# EAGLE schematic V3 nrf5 (EAGLE 9.6.2)
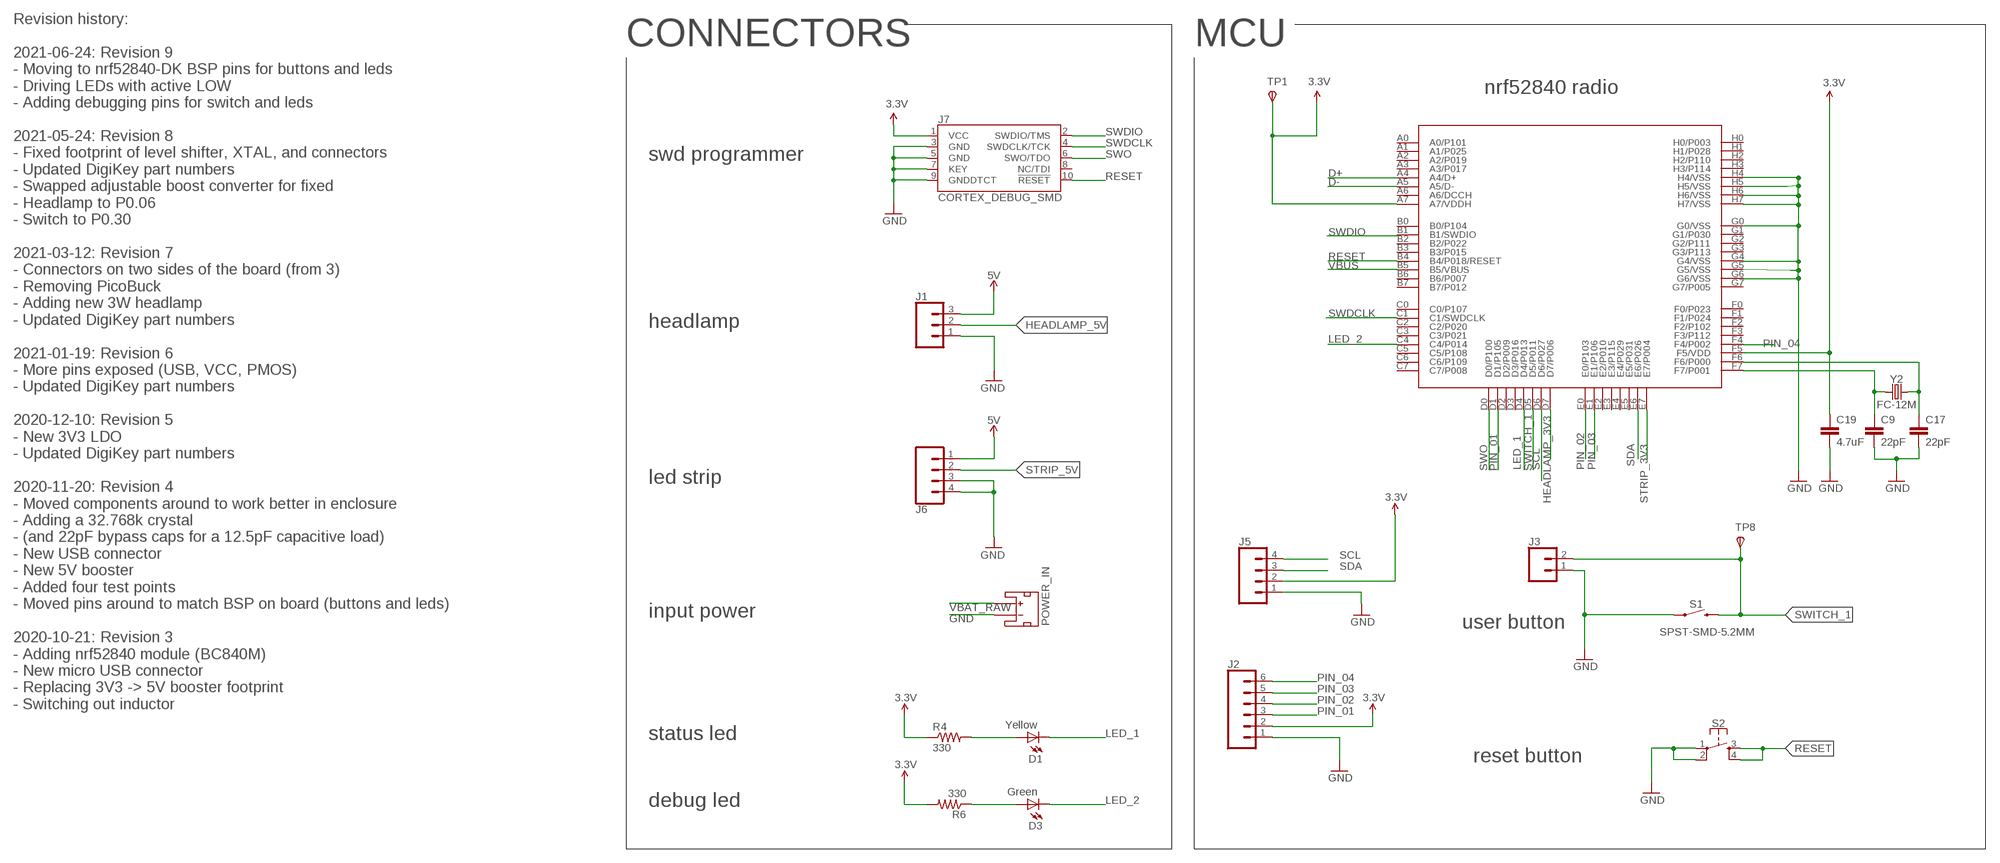
[diagram p0: schematic, sheet 1, part 1 of 2]
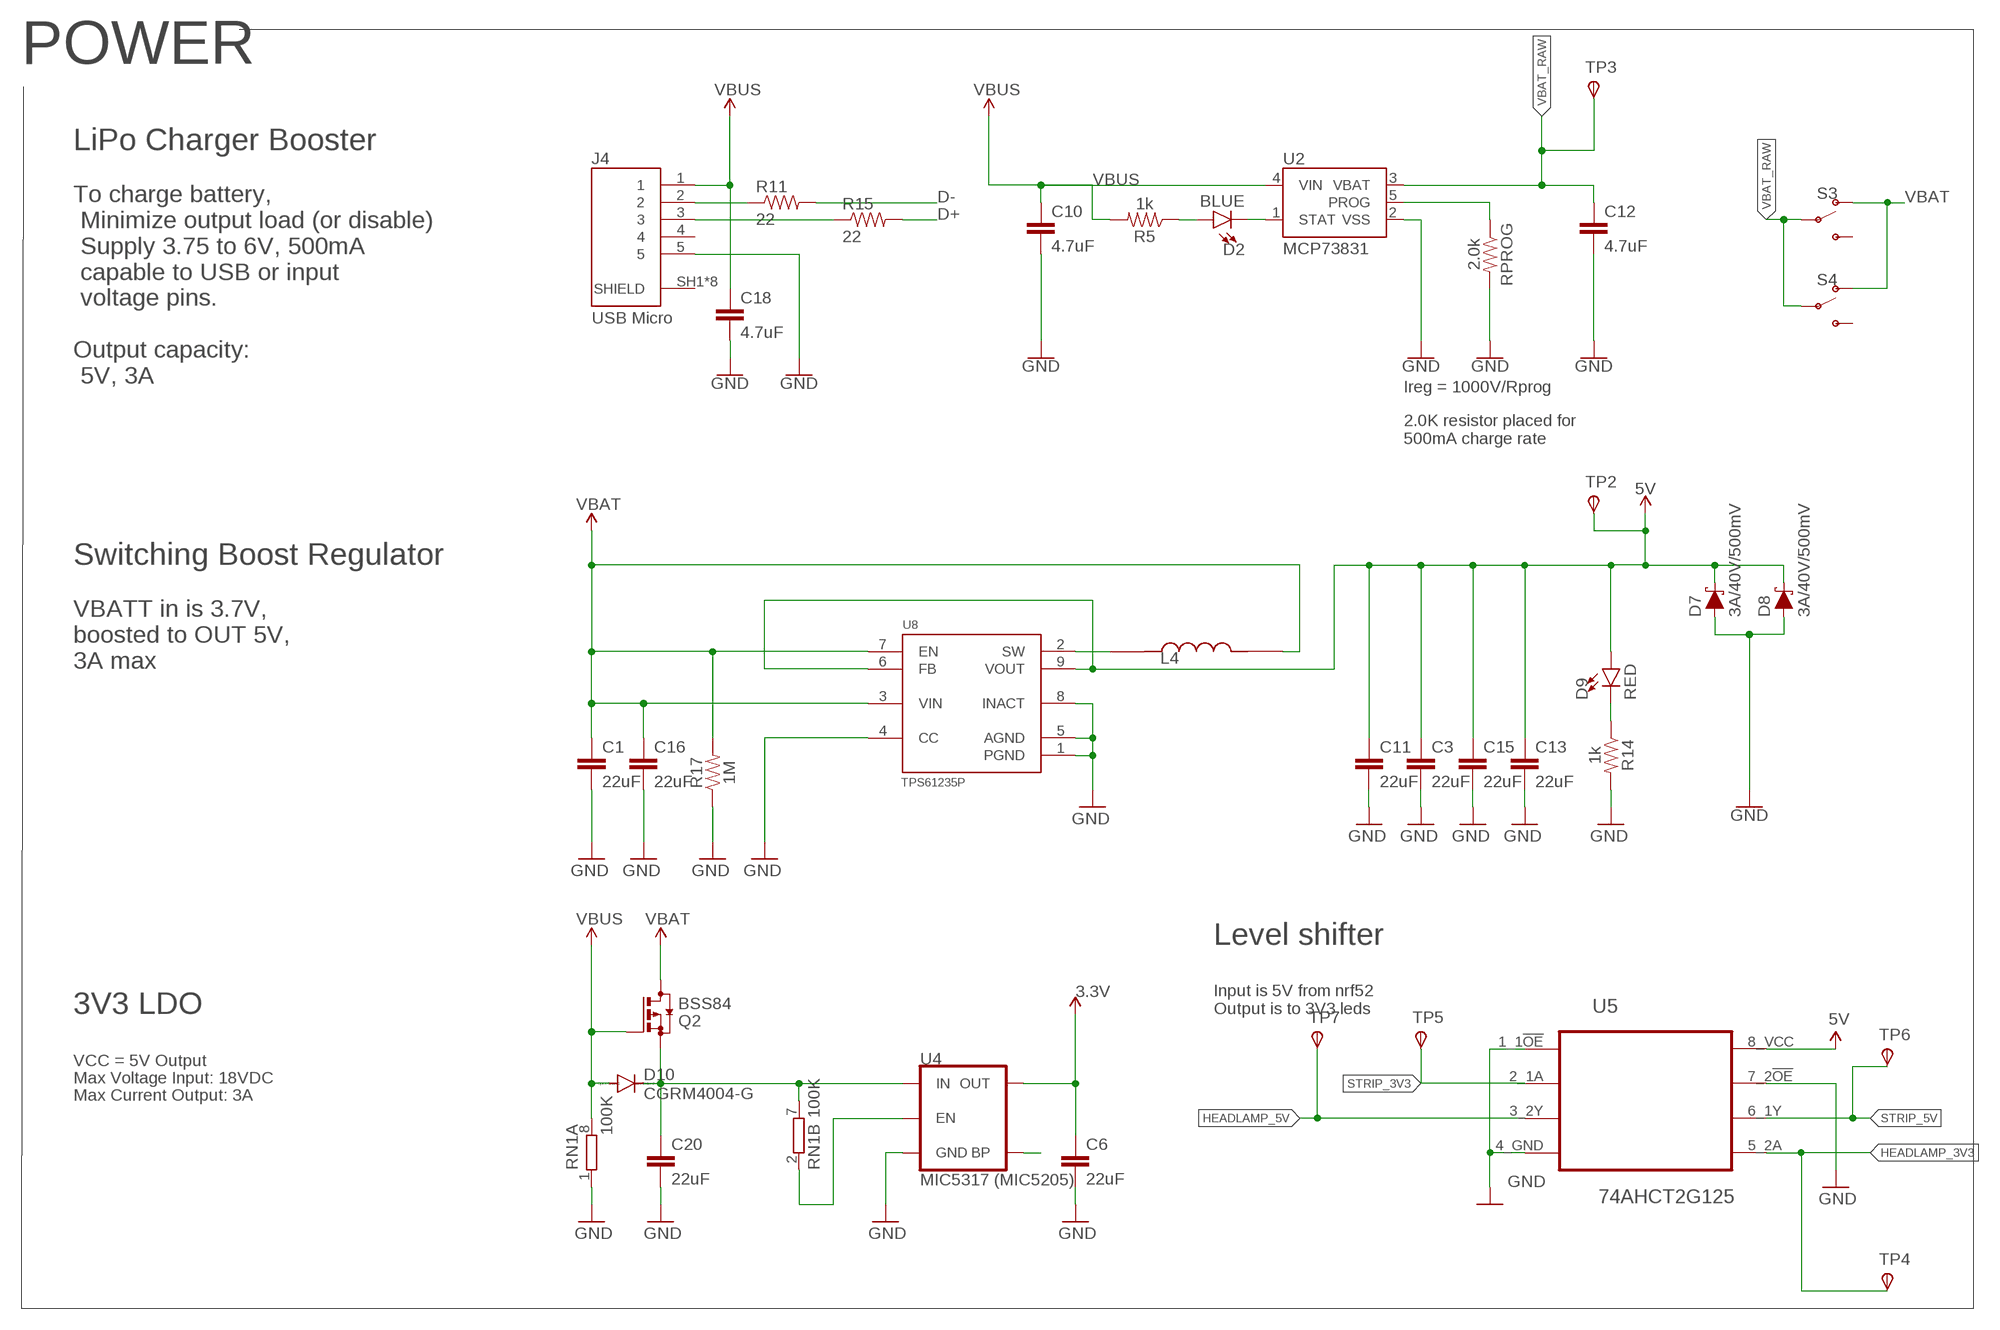
[diagram p1: schematic, sheet 1, part 2 of 2]

## Parts
C1  22uF  22UF-0805-6.3V-20%  [0805]
C3  22uF  22UF-0805-6.3V-20%  [0805]
C6  22uF  22UF-0805-6.3V-20%  [0805]
C9  22pF  22UF-0805-6.3V-20%  [0805]
C10  4.7uF  4.7UF0603  [0603]
C11  22uF  22UF-0805-6.3V-20%  [0805]
C12  4.7uF  4.7UF0603  [0603]
C13  22uF  22UF-0805-6.3V-20%  [0805]
C15  22uF  22UF-0805-6.3V-20%  [0805]
C16  22uF  22UF-0805-6.3V-20%  [0805]
C17  22pF  22UF-0805-6.3V-20%  [0805]
C18  4.7uF  4.7UF0603  [0603]
C19  4.7uF  4.7UF0603  [0603]
C20  22uF  22UF-0805-6.3V-20%  [0805]
D1  Yellow  LED0603  [LED-0603]
D2  BLUE  LED-BLUE0603  [LED-0603]
D3  Green  LED0603  [LED-0603]
D7  3A/40V/500mV  DIODE-SCHOTTKY-B340A  [SMA-DIODE]
D8  3A/40V/500mV  DIODE-SCHOTTKY-B340A  [SMA-DIODE]
D9  RED  LED-RED0603  [LED-0603]
D10  CGRM4004-G  [SOD-123_MINI-SMA]
J1  CONN_03SCREW_LOCK  [SCREWTERMINAL-3.5MM-3_LOCK.007S]
J2  CONN_06SMD-1MM  [1X06-1MM]
J3  CONN_02  [1X02]
J4  USB Micro  1050170001  [MOLEX_1050170001]
J5  CONN_04SMD2  [1X04_1MM_RA]
J6  CONN_04SCREW  [SCREWTERMINAL-3.5MM-4]
J7  CORTEX_DEBUG_SMD  [SAMTECH_FTSH-105-01]
L4  1.0 uH  FDSD0630-H-1R0M=P3  [IND_FDSD0630-H-1R0M=P3]
POWER_IN  JST_2MM_MALE  [JST-2-SMD]
Q2  BSS84  [SOT23]
R4  330  RESISTOR0603-RES  [0603-RES]
R5  1k  1KOHM-0603-1/10W-1%  [0603]
R6  330  RESISTOR0603-RES  [0603-RES]
R11  22  RESISTOR0603-RES  [0603-RES]
R14  1k  1KOHM-0603-1/10W-1%  [0603]
R15  22  RESISTOR0603-RES  [0603-RES]
R17  1M  750KOHM-0603-1/10W-1%  [0603@1]
RN1  100K  4R-NEXB38V  [EXB38V]
RPROG  2.0k  2.0KOHM-0603-1/10W-5%  [0603]
S1  SPST-SMD-5.2MM  MOMENTARY-SWITCH-SPST-SMD-5.2MM  [TACTILE_SWITCH_SMD_5.2MM]
S2  MOMENTARY-SWITCH-SPST-2-SMD-4.6X2.8MM  [TACTILE_SWITCH_SMD_4.6X2.8MM]
S3  SWITCH-SPDT-SMD-RIGHT-ANGLE  [SWITCH_SPST_SMD_A]
S4  SWITCH-SPDT-PTH-11.6X4.0MM  [SWITCH_SPDT_PTH_11.6X4.0MM]
TP1  TPSB1,27  [B1,27]
TP2  TPSB1,27  [B1,27]
TP3  TPSB1,27  [B1,27]
TP4  TPSB1,27  [B1,27]
TP5  TPSB1,27  [B1,27]
TP6  TPSB1,27  [B1,27]
TP7  TPSB1,27  [B1,27]
TP8  TPSB1,27  [B1,27]
U2  MCP73831  [SOT23-5]
U3  BC840M  [BC840M]
U4  MIC5317 (MIC5205)  V_REG_MIC52053.3V  [SOT23-5]
U5  74AHCT2G125  VSSOP-8_DEVICE  [VSSOP-8]
U8  TPS61235P  TPS61235PRWLR  [CONV_TPS61235PRWLR]
Y2  FC-12M  [FC-12M]

## Nets
3.3V: C6.1 C19.1 J2.2 J5.2 J7.1(VCC) R4.1 R6.2 TP1.TP(PP) U3.A7(A7/VDDH) U3.F5(F5/VDD) U4.5(OUT) ; supply symbol labelled VCC
5V: C3.1 C11.1 C13.1 C15.1 D7.C D8.C D9.A J1.3 J6.1 TP2.TP(PP) U5.8_VCC U8.6(FB) U8.9(VOUT)
D+: R15.2 U3.A4(A4/D+)
D-: R11.2 U3.A5(A5/D-)
GND: C1.2 C3.2 C6.2 C9.2 C10.2 C11.2 C12.2 C13.2 C15.2 C16.2 C17.2 C18.2 C19.2 C20.2 D7.A D8.A J1.1 J2.1 J3.1 J4.5 J5.1 J6.3 J6.4 J7.3(GND) J7.5(GND) J7.7(KEY) J7.9(GNDDTCT) POWER_IN.1(-) R14.2 R17.1 RN1.1 RPROG.2 S1.1 S2.1 S2.2 U2.2(VSS) U3.G0(G0/VSS) U3.G4(G4/VSS) U3.G5(G5/VSS) U3.G6(G6/VSS) U3.H4(H4/VSS) U3.H5(H5/VSS) U3.H6(H6/VSS) U3.H7(H7/VSS) U4.2(GND) U5.1_1!OE U5.4_GND U5.7_2!OE U8.1(PGND) U8.4(CC) U8.5(AGND) U8.8(INACT)
HEADLAMP_3V3: TP4.TP(PP) U3.D7(D7/P006) U5.5_2A
HEADLAMP_5V: J1.2 TP7.TP(PP) U5.3_2Y
LED_1: D1.C U3.D4(D4/P013)
LED_2: D3.C U3.C4(C4/P014)
N$1: D1.A R4.2
N$2: C9.1 U3.F7(F7/P001) Y2.1
N$3: L4.1 U8.2(SW)
N$4: C20.1 D10.C Q2.2(S) RN1.7 U4.1(IN)
N$5: RN1.2 U4.3(EN)
N$6: U4.4(BP)
N$8: D3.A R6.1
N$11: RPROG.1 U2.5(PROG)
N$12: J4.2 R11.1
N$13: D9.C R14.1
N$14: D2.C U2.1(STAT)
N$15: D2.A R5.1
N$16: J4.3 R15.1
N$17: C17.1 U3.F6(F6/P000) Y2.2
PIN_01: J2.3 U3.D1(D1/P105)
PIN_02: J2.4 U3.E0(E0/P103)
PIN_03: J2.5 U3.E1(E1/P106)
PIN_04: J2.6 U3.F4(F4/P002)
RESET: J7.10(!RESET) S2.3 S2.4 U3.B4(B4/P018/RESET)
SCL: J5.4 U3.D6(D6/P027)
SDA: J5.3 U3.E6(E6/P026)
STRIP_3V3: TP5.TP(PP) U3.E7(E7/P004) U5.2_1A
STRIP_5V: J6.2 TP6.TP(PP) U5.6_1Y
SWDCLK: J7.4(SWDCLK/TCK) U3.C1(C1/SWDCLK)
SWDIO: J7.2(SWDIO/TMS) U3.B1(B1/SWDIO)
SWITCH_1: J3.2 S1.3 TP8.TP(PP) U3.D5(D5/P011)
SWO: J7.6(SWO/TDO) U3.D0(D0/P100)
VBAT: C1.1 C16.1 L4.2 Q2.3(D) R17.2 S3.1(O) S4.1(O) U8.3(VIN) U8.7(EN)
VBAT_RAW: C12.1 POWER_IN.2(+) S3.2(P) S4.2(P) TP3.TP(PP) U2.3(VBAT)
VBUS: C10.1 C18.1 D10.A J4.1 Q2.1(G) R5.2 RN1.8 U2.4(VIN) U3.B5(B5/VBUS)
Unconnected: J4.4 J4.SH1(SHIELD) J4.SH2(SHIELD) J4.SH3(SHIELD) J4.SH4(SHIELD) J4.SH5(SHIELD) J4.SH6(SHIELD) J4.SH7(SHIELD) J4.SH8(SHIELD) J7.8(NC/TDI) POWER_IN.NC1(PAD1) POWER_IN.NC2(PAD2) RN1.3 RN1.4 RN1.5 RN1.6 S3.3(S) S4.3(S) U3.A0(A0/P101) U3.A1(A1/P025) U3.A2(A2/P019) U3.A3(A3/P017) U3.A6(A6/DCCH) U3.B0(B0/P104) U3.B2(B2/P022) U3.B3(B3/P015) U3.B6(B6/P007) U3.B7(B7/P012) U3.C0(C0/P107) U3.C2(C2/P020) U3.C3(C3/P021) U3.C5(C5/P108) U3.C6(C6/P109) U3.C7(C7/P008) U3.D2(D2/P009) U3.D3(D3/P016) U3.E2(E2/P010) U3.E3(E3/P115) U3.E4(E4/P029) U3.E5(E5/P031) U3.F0(F0/P023) U3.F1(F1/P024) U3.F2(F2/P102) U3.F3(F3/P112) U3.G1(G1/P030) U3.G2(G2/P111) U3.G3(G3/P113) U3.G7(G7/P005) U3.H0(H0/P003) U3.H1(H1/P028) U3.H2(H2/P110) U3.H3(H3/P114)

## Notes on the sheet
- Revision history:
  
  2021-06-24: Revision 9
  - Moving to nrf52840-DK BSP pins for buttons and leds
  - Driving LEDs with active LOW
  - Adding debugging pins for switch and leds
  
  2021-05-24: Revision 8
  - Fixed footprint of level shifter, XTAL, and connectors
  - Updated DigiKey part numbers
  - Swapped adjustable boost converter for fixed
  - Headlamp to P0.06
  - Switch to P0.30
  
  2021-03-12: Revision 7
  - Connectors on two sides of the board (from 3)
  - Removing PicoBuck
  - Adding new 3W headlamp
  - Updated DigiKey part numbers
  
  2021-01-19: Revision 6
  - More pins exposed (USB, VCC, PMOS)
  - Updated DigiKey part numbers
  
  2020-12-10: Revision 5
  - New 3V3 LDO
  - Updated DigiKey part numbers
  
  2020-11-20: Revision 4
  - Moved components around to work better in enclosure
  - Adding a 32.768k crystal 
  - (and 22pF bypass caps for a 12.5pF capacitive load) 
  - New USB connector
  - New 5V booster
  - Added four test points
  - Moved pins around to match BSP on board (buttons and leds)
  
  2020-10-21: Revision 3
  - Adding nrf52840 module (BC840M)
  - New micro USB connector
  - Replacing 3V3 -> 5V booster footprint
  - Switching out inductor
- CONNECTORS | MCU | POWER
- nrf52840 radio
- LiPo Charger Booster
- To charge battery,
   Minimize output load (or disable)
   Supply 3.75 to 6V, 500mA
   capable to USB or input
   voltage pins.
- swd programmer
- Output capacity:
   5V, 3A
- Ireg = 1000V/Rprog
- 2.0K resistor placed for
  500mA charge rate
- headlamp
- Switching Boost Regulator
- VBATT in is 3.7V, 
  boosted to OUT 5V, 
  3A max
- led strip
- input power
- user button | Level shifter
- 3V3 LDO
- Input is 5V from nrf52
  Output is to 3V3 leds
- VCC = 5V Output
- Max Voltage Input: 18VDC
- Max Current Output: 3A
- status led
- reset button
- debug led

## Library data of the parts
C1 C3 C6 C11 C13 C15 C16 C20 = SparkFun-Capacitors:22UF: 22µF ceramic capacitors A capacitor is a passive two-terminal electrical component used to store electrical energy temporarily in an electric field.; DIGIKEY: 490-10511-1-ND; PROD_ID: CAP-08402
C9 C17 = SparkFun-Capacitors:22UF: 22µF ceramic capacitors A capacitor is a passive two-terminal electrical component used to store electrical energy temporarily in an electric field.; DIGIKEY: 399-C0805C220K5HAC7800CT-ND; PROD_ID: CAP-08402; VALUE: 22uF
C10 C12 C18 C19 = SparkFun-Capacitors:4.7UF: 4.7µF ceramic capacitors A capacitor is a passive two-terminal electrical component used to store electrical energy temporarily in an electric field.; DIGIKEY: 399-3482-1-ND; PROD_ID: CAP-08280
D1 = SparkFun:LED: LEDs Standard schematic elements and footprints for 5mm, 3mm, 1206, and 0603 sized LEDs. 5mm - Spark Fun Electronics SKU : COM-00529 (and others); DIGIKEY: 350-4349-2-ND
D2 = SparkFun-LED:LED-BLUE: Blue SMD LED Used in manufacturing of various products at SparkFun Packages: 0603 - SMD 0603 package [Product Link] <http://www.digikey.com/product-detail/en/SMLE12BC7TT86/511-1589-2-ND/1641808> 1206 - SMD1206 package [Product Link] <http://www.digikey.com/product-detail/en/lite-on-inc/LTST-C150TBKT/160-1643-1-ND/573584> SparkFun Products: ESP8266 Thing-Dev Board <https://www.sparkfun.com/products/13711> RedBoard <https://www.sparkfun.com/products/12757>; DIGIKEY: 160-1647-1-ND; PROD_ID: DIO-08575
D3 = SparkFun:LED: LEDs Standard schematic elements and footprints for 5mm, 3mm, 1206, and 0603 sized LEDs. 5mm - Spark Fun Electronics SKU : COM-00529 (and others); DIGIKEY: 754-1116-1-ND
D7 D8 = SparkFun-DiscreteSemi:DIODE-SCHOTTKY: Schottky diode A Schottky diode is a semiconductor diode which has a low forward voltage drop and a very fast switching action.; DIGIKEY: B240AE-13DITR-ND; PROD_ID: DIO-09886
D9 = SparkFun-LED:LED-RED: Red SMD LED Used in manufacturing of most products at SparkFun Packages: 0603 - SMD 0603 package [Product Link] <http://docs.avagotech.com/docs/AV02-0551EN> 0603 SMART - SMD 0603 SMART package ( more efficient and expensive)[Product Link] <http://www.osram-os.com/Graphics/XPic2/00077099_0.pdf> 1206 - SMD1206 package [Product Link] <https://www.sparkfun.com/datasheets/DevTools/LilyPad/Q150OVS4.pdff> SparkFun Products: Pro Mini 328 -5V <https://www.sparkfun.com/products/821> RedBoard <https://www.sparkfun.com/products/12757> IOIO-OTG <https://www.sparkfun.com/products/13613>; DIGIKEY: 160-1436-1-ND; PROD_ID: DIO-00819
D10 = diode:CGRM400*-G: Molded plasitc,JEDEC SOD-123/Mini SMA Source: Comchip CGRM4001-G.pdf; DIGIKEY: MBR120LSFT3GOSTR-ND
J1 = SparkFun-Connectors:CONN_03: Multi connection point. Often used as Generic Header-pin footprint for 0.1 inch spaced/style header connections On any of the 0.1 inch spaced packages, you can populate with these: Break Away Headers - Straight <https://www.sparkfun.com/products/116> (PRT-00116) Break Away Male Headers - Right Angle <https://www.sparkfun.com/products/553> (PRT-00553) Female Headers <https://www.sparkfun.com/products/115> (PRT-00115) Break Away Headers - Machine Pin <https://www.sparkfun.com/products/117> (PRT-00117) Break Away Female Headers - Swiss Machine Pin <https://www.sparkfun.com/products/743> (PRT-00743) Stackable Header - 3 Pin (Female, 0.1") <https://www.sparkfun.com/products/13875> (PRT-13875) For SCREWTERMINALS and SPRING TERMINALS visit here: Screw Terimnals on SparkFun.com <https://www.sparkfun.com/search/results?term=Screw+Terminals> (5mm/3.5mm/2.54mm spacing) This device is also useful as a general connection point to wire up your design to another part of your project. Our various solder wires solder well into these plated through hole pads. Hook-Up Wire - Assortment (Stranded, 22 AWG) <https://www.sparkfun.com/products/11375> (PRT-11375) Hook-Up Wire - Assortment (Solid Core, 22 AWG) <https://www.sparkfun.com/products/11367> (PRT-11367) View the entire wire category on our website here <https://www.sparkfun.com/categories/141> Special notes: Molex polarized connector foot print use with SKU : PRT-08232 with associated crimp pins and housings.; DIGIKEY: A98037-ND; PROD_ID: CONN-08288; SF_ID: PRT-08235
J2 = SparkFun-Connectors:CONN_06: Multi connection point. Often used as Generic Header-pin footprint for 0.1 inch spaced/style header connections On any of the 0.1 inch spaced packages, you can populate with these: Break Away Headers - Straight <https://www.sparkfun.com/products/116> (PRT-00116) Break Away Male Headers - Right Angle <https://www.sparkfun.com/products/553> (PRT-00553) Female Headers <https://www.sparkfun.com/products/115> (PRT-00115) Break Away Headers - Machine Pin <https://www.sparkfun.com/products/117> (PRT-00117) Break Away Female Headers - Swiss Machine Pin <https://www.sparkfun.com/products/743> (PRT-00743) Arduino Stackable Header - 6 Pin <https://www.sparkfun.com/products/9280> (PRT-09280) For SCREWTERMINALS and SPRING TERMINALS visit here: Screw Terimnals on SparkFun.com <https://www.sparkfun.com/search/results?term=Screw+Terminals> (5mm/3.5mm/2.54mm spacing) This device is also useful as a general connection point to wire up your design to another part of your project. Our various solder wires solder well into these plated through hole pads. Hook-Up Wire - Assortment (Stranded, 22 AWG) <https://www.sparkfun.com/products/11375> (PRT-11375) Hook-Up Wire - Assortment (Solid Core, 22 AWG) <https://www.sparkfun.com/products/11367> (PRT-11367) View the entire wire category on our website here <https://www.sparkfun.com/categories/141>; PROD_ID: CONN-08249; SF_ID: GPS-00579
J3 = SparkFun-Connectors:CONN_02: Multi connection point. Often used as Generic Header-pin footprint for 0.1 inch spaced/style header connections On any of the 0.1 inch spaced packages, you can populate with these: Break Away Headers - Straight <https://www.sparkfun.com/products/116> (PRT-00116) Break Away Male Headers - Right Angle <https://www.sparkfun.com/products/553> (PRT-00553) Female Headers <https://www.sparkfun.com/products/115> (PRT-00115) Break Away Headers - Machine Pin <https://www.sparkfun.com/products/117> (PRT-00117) Break Away Female Headers - Swiss Machine Pin <https://www.sparkfun.com/products/743> (PRT-00743) For SCREWTERMINALS and SPRING TERMINALS visit here: Screw Terimnals on SparkFun.com <https://www.sparkfun.com/search/results?term=Screw+Terminals> (5mm/3.5mm/2.54mm spacing) This device is also useful as a general connection point to wire up your design to another part of your project. Our various solder wires solder well into these plated through hole pads. Hook-Up Wire - Assortment (Stranded, 22 AWG) <https://www.sparkfun.com/products/11375> (PRT-11375) Hook-Up Wire - Assortment (Solid Core, 22 AWG) <https://www.sparkfun.com/products/11367> (PRT-11367) View the entire wire category on our website here <https://www.sparkfun.com/categories/141> Special notes: Molex polarized connector foot print use with: PRT-08233 with associated crimp pins and housings. 2.54_SCREWTERM for use with PRT-10571. 3.5mm Screw Terminal footprints for PRT-08084 5mm Screw Terminal footprints for use with PRT-08432
J4 = 1050170001:1050170001: Conn.; Data; USB; Recept.; Micro; B Type; Bottom Mount, SMT, with Solder Tabs, Lead-Free Check prices <https://pricing.snapeda.com/parts/1050170001/Molex/view-part?ref=eda>; AVAILABILITY: Good; DESCRIPTION: USB - micro B USB 2.0 Receptacle Connector 5 Position Surface Mount, Right Angle; Through Hole; DIGIKEY: WM1399CT-ND; MF: Molex; MP: 1050170001; PACKAGE: None; PRICE: None; PURCHASE-URL: https://pricing.snapeda.com/search/part/1050170001/?ref=eda
J5 = SparkFun-Connectors:CONN_04: Multi connection point. Often used as Generic Header-pin footprint for 0.1 inch spaced/style header connections On any of the 0.1 inch spaced packages, you can populate with these: Break Away Headers - Straight <https://www.sparkfun.com/products/116> (PRT-00116) Break Away Male Headers - Right Angle <https://www.sparkfun.com/products/553> (PRT-00553) Female Headers <https://www.sparkfun.com/products/115> (PRT-00115) Break Away Headers - Machine Pin <https://www.sparkfun.com/products/117> (PRT-00117) Break Away Female Headers - Swiss Machine Pin <https://www.sparkfun.com/products/743> (PRT-00743) For SCREWTERMINALS and SPRING TERMINALS visit here: Screw Terimnals on SparkFun.com <https://www.sparkfun.com/search/results?term=Screw+Terminals> (5mm/3.5mm/2.54mm spacing) This device is also useful as a general connection point to wire up your design to another part of your project. Our various solder wires solder well into these plated through hole pads. Hook-Up Wire - Assortment (Stranded, 22 AWG) <https://www.sparkfun.com/products/11375> (PRT-11375) Hook-Up Wire - Assortment (Solid Core, 22 AWG) <https://www.sparkfun.com/products/11367> (PRT-11367) View the entire wire category on our website here <https://www.sparkfun.com/categories/141> Special notes: Molex polarized connector foot print use with SKU : PRT-08231 with associated crimp pins and housings. 1MM SMD Version SKU: PRT-10208; PROD_ID: CONN-10310; SF_ID: PRT-10208
J6 = SparkFun-Connectors:CONN_04: Multi connection point. Often used as Generic Header-pin footprint for 0.1 inch spaced/style header connections On any of the 0.1 inch spaced packages, you can populate with these: Break Away Headers - Straight <https://www.sparkfun.com/products/116> (PRT-00116) Break Away Male Headers - Right Angle <https://www.sparkfun.com/products/553> (PRT-00553) Female Headers <https://www.sparkfun.com/products/115> (PRT-00115) Break Away Headers - Machine Pin <https://www.sparkfun.com/products/117> (PRT-00117) Break Away Female Headers - Swiss Machine Pin <https://www.sparkfun.com/products/743> (PRT-00743) For SCREWTERMINALS and SPRING TERMINALS visit here: Screw Terimnals on SparkFun.com <https://www.sparkfun.com/search/results?term=Screw+Terminals> (5mm/3.5mm/2.54mm spacing) This device is also useful as a general connection point to wire up your design to another part of your project. Our various solder wires solder well into these plated through hole pads. Hook-Up Wire - Assortment (Stranded, 22 AWG) <https://www.sparkfun.com/products/11375> (PRT-11375) Hook-Up Wire - Assortment (Solid Core, 22 AWG) <https://www.sparkfun.com/products/11367> (PRT-11367) View the entire wire category on our website here <https://www.sparkfun.com/categories/141> Special notes: Molex polarized connector foot print use with SKU : PRT-08231 with associated crimp pins and housings. 1MM SMD Version SKU: PRT-10208; DIGIKEY: 277-1860-ND; PROD_ID: 2xCONN-08399; SF_ID: 2xPRT-08084
J7 = SparkFun-Connectors:CORTEX_DEBUG: Cortex Debug Connector - 10 pin Supports JTAG debug, Serial Wire debug, and Serial Wire Viewer. PTH and SMD connector options available. General Connector Information <http://infocenter.arm.com/help/topic/com.arm.doc.faqs/attached/13634/cortex_debug_connectors.pdf> Products: PTH Connector <http://www.digikey.com/product-detail/en/cnc-tech/3220-10-0100-00/1175-1627-ND/3883661> -via Digi-Key SparkFun PSoc <https://www.sparkfun.com/products/13229> SparkFun T <https://www.sparkfun.com/products/13810>; DIGIKEY: SAM1161-05-ND
L4 = FDSD0630-H-1R0M_P3:FDSD0630-H-1R0M=P3: 2.2µH Shielded Wirewound Inductor 7.1A 17mOhm Max Nonstandard; DESCRIPTION: Inductor with Inductance: 1uH Tol. +/-20%, Package: 2726 (7066); DIGI-KEY_PART_NUMBER: 490-10878-1-ND; DIGIKEY: 490-10878-1-ND; MF: Murata; MP: FDSD0630-H-1R0M=P3; PACKAGE: NONSTANDARD; PURCHASE-URL: https://pricing.snapeda.com/search/part/FDSD0630-H-1R0M=P3/?ref=eda
POWER_IN = SparkFun-Connectors:JST_2MM_MALE: JST 2MM MALE RA CONNECTOR Two pin, compact surface mount connector. Commonly used as a battery input connection point. We really like the solid locking feeling and high current rating on these small connectors. We use these all the time as battery connectors. Mates to single-cell LiPo batteries. Here is the connector we sell at SparkFun: JST Right Angle Connector - White <https://www.sparkfun.com/products/8612> (PRT-08612) Datasheet <http://www.sparkfun.com/datasheets/Prototyping/Connectors/JST-Horizontal.pdf> It was used on these SparkFun products: SparkFun MOSFET Power Controller <https://www.sparkfun.com/products/11214> (PRT-11214) SparkFun Battery Babysitter - LiPo Battery Manager <https://www.sparkfun.com/products/13777> (PRT-13777) And many, many others that required a lipo battery connection.; DIGIKEY: 732-2711-2-ND; PROD_ID: CONN-11443; SF_ID: PRT-08612
Q2 = transistor-small-signal:BSS84: P-CHANNEL MOS FET; DIGIKEY: TSM2305CXRFGTR-ND
R4 R6 = SparkFun:RESISTOR: Resistor Basic schematic elements and footprints for 0603, 1206, and PTH resistors.; DIGIKEY: 311-330HRTR-ND
R5 = SparkFun-Resistors:1KOHM: 1kΩ resistor A resistor is a passive two-terminal electrical component that implements electrical resistance as a circuit element. Resistors act to reduce current flow, and, at the same time, act to lower voltage levels within circuits. - Wikipedia; DIGIKEY: RMCF0603FG1K00CT-ND; PROD_ID: RES-07856
R11 R15 = SparkFun:RESISTOR: Resistor Basic schematic elements and footprints for 0603, 1206, and PTH resistors.; DIGIKEY: 311-22.0HRTR-ND
R14 = SparkFun-Resistors:1KOHM: 1kΩ resistor A resistor is a passive two-terminal electrical component that implements electrical resistance as a circuit element. Resistors act to reduce current flow, and, at the same time, act to lower voltage levels within circuits. - Wikipedia; DIGIKEY: RMCF0603FG1K00; PROD_ID: RES-07856
R17 = SparkFun-Resistors:750KOHM: 750Ω resistor A resistor is a passive two-terminal electrical component that implements electrical resistance as a circuit element. Resistors act to reduce current flow, and, at the same time, act to lower voltage levels within circuits. - Wikipedia; DIGIKEY: RMCF0603FT1M00; PROD_ID: RES-13768; VALUE: 750K
RN1 = resistor-dil:4R-N: Array Chip Resistor Source: RS Component / Phycomp; DIGIKEY: YC164J-100KCT-ND; OC_FARNELL: unknown; OC_NEWARK: unknown
RPROG = SparkFun-Resistors:2.0KOHM: 2kΩ resistor A resistor is a passive two-terminal electrical component that implements electrical resistance as a circuit element. Resistors act to reduce current flow, and, at the same time, act to lower voltage levels within circuits. - Wikipedia; DIGIKEY: ‎311-2.00KHRCT-ND‎; PROD_ID: RES-08296
S1 = SparkFun-Switches:MOMENTARY-SWITCH-SPST: Momentary Switch (Pushbutton) - SPST Normally-open (NO) SPST momentary switches (buttons, pushbuttons). Variants PTH-12MM - 12mm square, through-hole Momentary Pushbutton Switch - 12mm Square <https://www.sparkfun.com/products/9190> (COM-09190) PTH-6.0MM, PTH-6.0MM-KIT - 6.0mm square, through-hole Mini Pushbutton Switch <https://www.sparkfun.com/products/97> (COM-00097) KIT package intended for soldering kit's - only one side of pads' copper is exposed. PTH-RIGHT-ANGLE-KIT - Right-angle, through-hole Right Angle Tactile Button <https://www.sparkfun.com/products/10791> - Used on SparkFun BigTime Watch Kit <https://www.sparkfun.com/products/11734> SMD-12MM - 12mm square, surface-mount Tactile Button - SMD (12mm) <https://www.sparkfun.com/products/12993> (COM-12993) Used on SparkFun PicoBoard <https://www.sparkfun.com/products/11888> SMD-4.5MM - 4.5mm Square Trackball Switch Used on SparkFun Blackberry Trackballer Breakout <https://www.sparkfun.com/products/13169> SMD-4.6MMX2.8MM - 4.60mm x 2.80mm, surface mount Used on SparkFun SAMD21 Mini Breakout <https://www.sparkfun.com/products/13664> SMD-5.2MM, SMD-5.2-REDUNDANT - 5.2mm square, surface-mount Mini Pushbutton Switch - SMD <https://www.sparkfun.com/products/8720> (COM-08720) Used on Arduino Pro Mini <https://www.sparkfun.com/products/11114> REDUNDANT package connects both switch circuits together SMD-6.0X3.5MM - 6.0 x 3.5mm, surface mount Momentary Reset Switch SMD <https://www.sparkfun.com/products/8229> (COM-08229) SMD-6.2MM-TALL - 6.2mm square, surface mount Tactile Button - SMD (6mm) <https://www.sparkfun.com/products/12992> Used on SparkFun Digital Sandbox <https://www.sparkfun.com/products/12651> SMD-RIGHT-ANGLE - Right-angle, surface mount Used on SparkFun Block for Intel® Edison - Arduino <https://www.sparkfun.com/products/13036>; DIGIKEY: CKN12222-1-ND; PROD_ID: SWCH-08247; SF_SKU: COM-08720
S2 = SparkFun-Switches:MOMENTARY-SWITCH-SPST-2: Momentary Switch (Pushbutton) - SPST - Two Circuits Normally-open (NO) SPST momentary switches (buttons, pushbuttons). Schematic symbol includes two switch circuits. Variants SMD-4.6MMX2.8MM - 4.60mm x 2.80mm Tactile Momentary Button Switch - Used on SparkFun SAMD21 Mini Breakout <https://www.sparkfun.com/products/13664> SMD-5.2MM - Mini Pushbutton Switch - SMD <https://www.sparkfun.com/products/8720> - Used on Arduino Pro Mini <https://www.sparkfun.com/products/11114>; DIGIKEY: 401-1426-1-ND; PROD_ID: SWCH-13065
S3 = SparkFun-Switches:SWITCH-SPDT: Single Pole, Double Throw (SPDT) Switch Single-pole, double-throw (SPDT) switch. Variant Overview SMD-AYZ0202 Surface Mount DPDT Switch <https://www.sparkfun.com/products/597> (COM-00597) Used on e.g. LilyPad Arduino USB - ATmega32U4 Board <https://www.sparkfun.com/products/12049> PTH-11.6X4.0MM SPDT Mini Power Switch <https://www.sparkfun.com/products/102> (COM-00102) Used on e.g. SparkFun Simon Says - Through-Hole Soldering Kit <https://www.sparkfun.com/products/10547> (KIT-10547) PTH-11.6X4.0MM-KIT KIT version of SPDT Mini Power Switch - Simplifies soldering by removing tStop of switch pins - only one side can be soldered. PTH-11.6X4.0MM-LOCK LOCK version of SPDT Mini Power Switch - Offset pins hold switch in place for easier soldering. SMD-RIGHT-ANGLE Surface Mount Right Angle Switch <https://www.sparkfun.com/products/10860> (COM-10860) Used on e.g. SparkFun ESP8266 Thing <https://www.sparkfun.com/products/13231>; DIGIKEY: 563-1102-1-ND; PROD_ID: SWCH-10651; SF_SKU: COM-10860
S4 = SparkFun-Switches:SWITCH-SPDT: Single Pole, Double Throw (SPDT) Switch Single-pole, double-throw (SPDT) switch. Variant Overview SMD-AYZ0202 Surface Mount DPDT Switch <https://www.sparkfun.com/products/597> (COM-00597) Used on e.g. LilyPad Arduino USB - ATmega32U4 Board <https://www.sparkfun.com/products/12049> PTH-11.6X4.0MM SPDT Mini Power Switch <https://www.sparkfun.com/products/102> (COM-00102) Used on e.g. SparkFun Simon Says - Through-Hole Soldering Kit <https://www.sparkfun.com/products/10547> (KIT-10547) PTH-11.6X4.0MM-KIT KIT version of SPDT Mini Power Switch - Simplifies soldering by removing tStop of switch pins - only one side can be soldered. PTH-11.6X4.0MM-LOCK LOCK version of SPDT Mini Power Switch - Offset pins hold switch in place for easier soldering. SMD-RIGHT-ANGLE Surface Mount Right Angle Switch <https://www.sparkfun.com/products/10860> (COM-10860) Used on e.g. SparkFun ESP8266 Thing <https://www.sparkfun.com/products/13231>; PROD_ID: SWCH-08261; SF_SKU: COM-00102
TP1-TP8 = testpad:TPS: TEST PIN
U2 = SparkFun-IC-Power:MCP73831: MCP73831T Li-Ion, Li-Pol Controller Miniature single cell, fully integrated Li-Ion, Li-polymer charge management controller Datasheet <http://ww1.microchip.com/downloads/en/DeviceDoc/20001984g.pdf> SparkFun Products: SparkFun ESP32 Thing <https://www.sparkfun.com/products/13907> SparkFun 9DoF Razor IMU M0 <https://www.sparkfun.com/products/14001>; DIGIKEY: MCP73832T-2DFI/OTTR-ND; PROD_ID: IC-09995
U3 = BC840M-v1:BC840M; DIGIKEY: 1914-BC840MCT-ND
U4 = SparkFun-IC-Power:V_REG_MIC5205: V_REG MIC5205 Standard 3.3V, 5V, and Adjustable 150mA LDO voltage regulator in SOT-23 layout. Micrel part MIC5205. BP (by-pass) pin is used to lower output noise with 470pF cap, may be left open. On the adjustable version BP is used to set output.; DIGIKEY: MIC5317-3.3YM5-TR-ND; MOUSER: 998-MIC5317-3.3YM5TR; PROD_ID: VREG-00822; VALUE: 3.3V/150mA
U5 = VSSOP8:VSSOP-8_DEVICE: Dual bidirectional I2C-bus and SMBus voltage-level translator; DIGIKEY: 1727-6544-1-ND‎; MPN: PCA9306DC,125; OC_FARNELL: -; OC_NEWARK: 70R6429; PACKAGE: VSSOP-8; SUPPLIER: NXP
U8 = TPS61235PRWLR:TPS61235PRWLR: TPS6123x 8-A Valley Current Synchronous Boost Converters with Constant Current Output Feature 9-VQFN-HR -40 to 85; DESCRIPTION: 8-A Valley Current Synchronous Boost Converters with Constant Current Output Feature 9-VQFN-HR -40 to 85; DIGI-KEY_PART_NUMBER: 296-47376-1-ND; DIGIKEY: 296-47376-2-ND; MF: Texas Instruments; MOUSER: 595-TPS61235PRWLR; MP: TPS61235PRWLR; PACKAGE: VQFN-HR-9 Texas Instruments; PURCHASE-URL: https://pricing.snapeda.com/search/part/TPS61235PRWLR/?ref=eda
Y2 = crystal:FC-12M: kHz RANGE CRYSTAL UNIT LOW PROFILE SMD Source: Epson Toyocom FC-12M.pdf; DIGIKEY: 2195-CM8V-T1A-32.768KHZ-12.5PF-20PPM-TA-QATR-ND

## Net classes
0 default: width 0.127 mm, drill 0.305 mm, clearance 0.152 mm
1 power: width 0.508 mm